# EAGLE design LB_BIT_i32_filter-v03(5_6) (EAGLE 6.6.0)
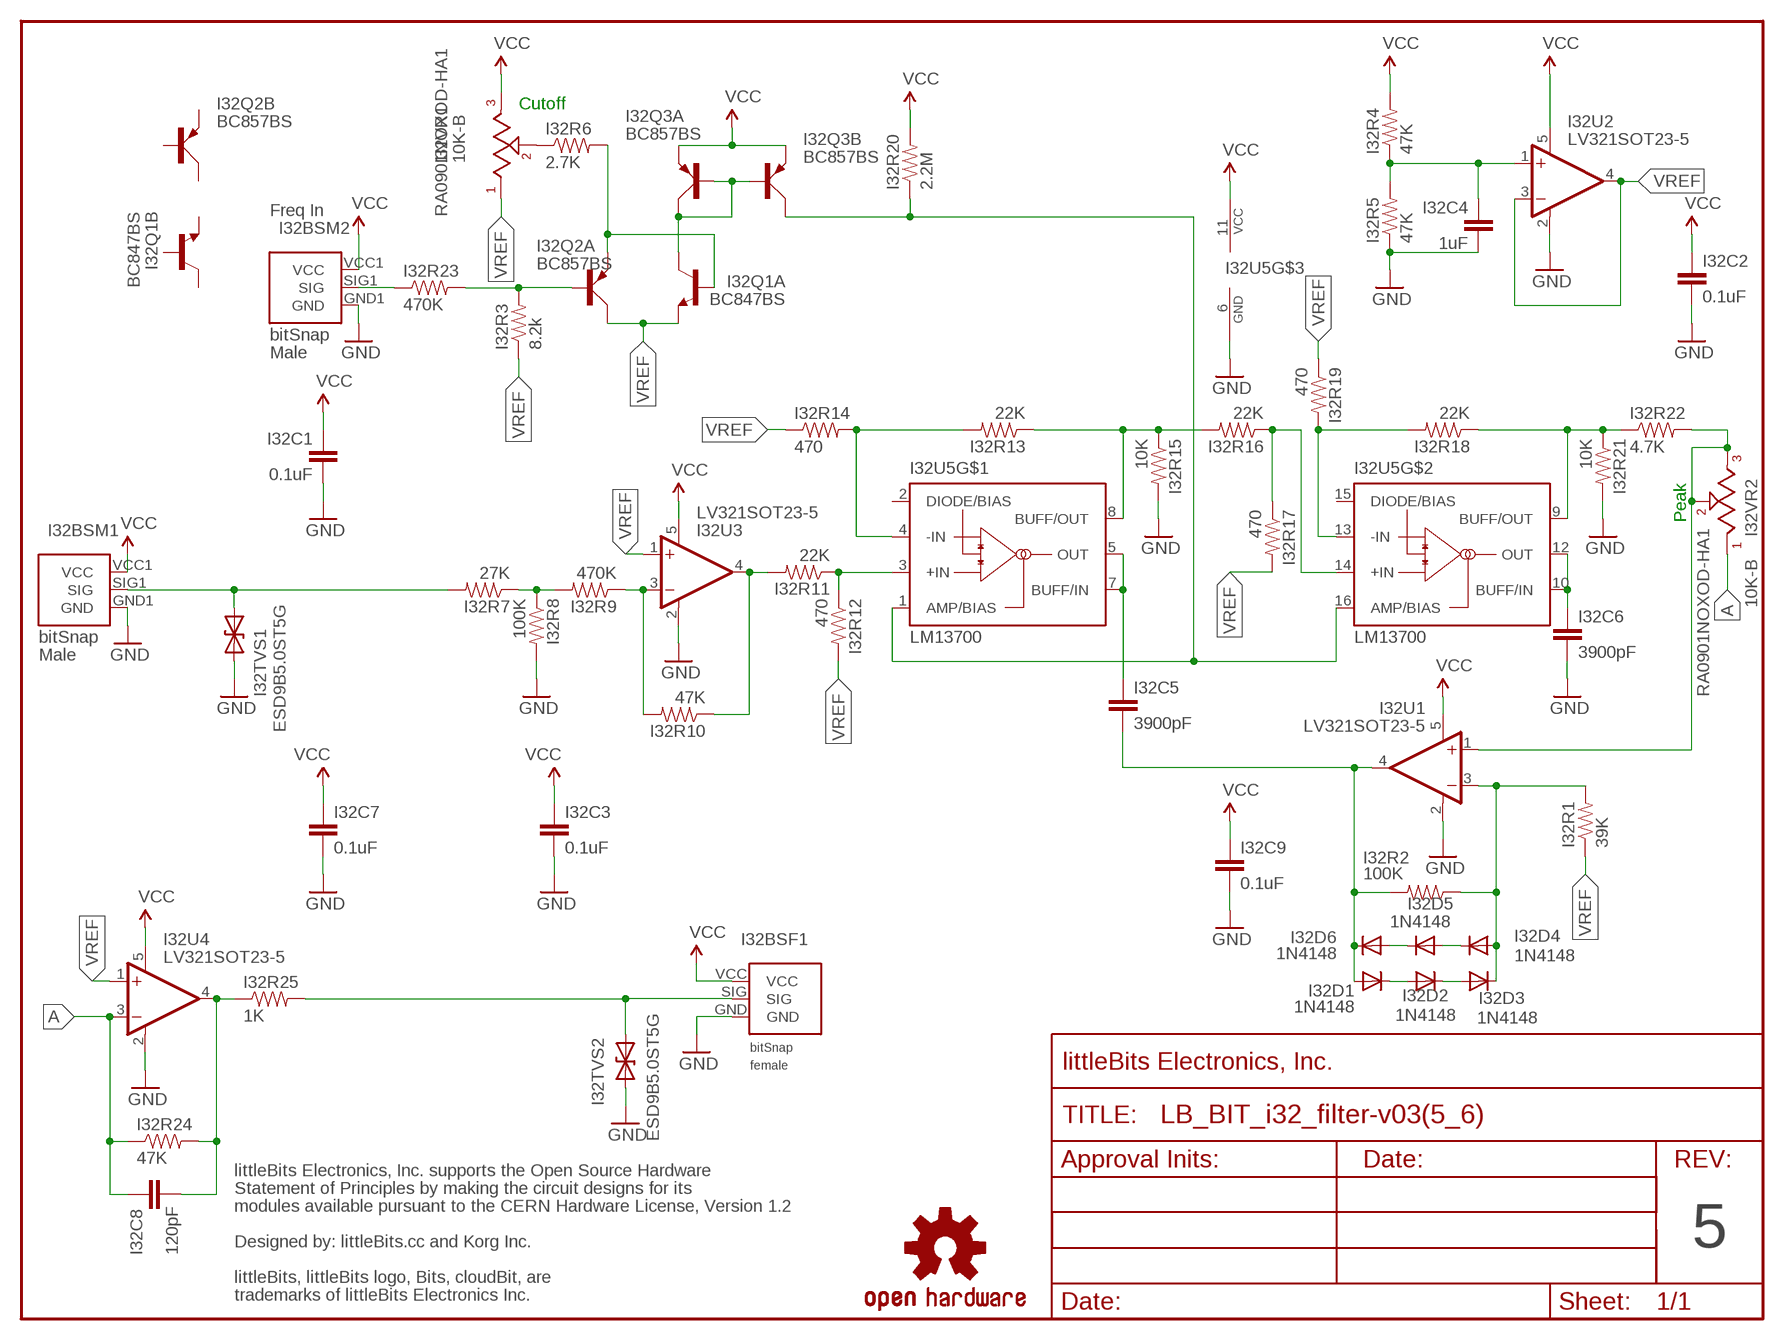
[diagram p0: schematic, sheet 1]

## Parts
I32BSF1  BITSNAP_V03_FEMALE  [BITSNAP_V03_FEMALE]
I32BSM1  BITSNAP_V03_MALE  [BITSNAP_V03_MALE]
I32BSM2  BITSNAP_V03_MALE  [BITSNAP_V03_MALE]
I32C1  0.1uF  CAPCAP-0603  [CAP-0603]
I32C2  0.1uF  CAPCAP-0603  [CAP-0603]
I32C3  0.1uF  CAPCAP-0603  [CAP-0603]
I32C4  1uF  CAPCAP-0603  [CAP-0603]
I32C5  3900pF  CAPCAP-0603  [CAP-0603]
I32C6  3900pF  CAPCAP-0603  [CAP-0603]
I32C7  0.1uF  CAPCAP-0603  [CAP-0603]
I32C8  120pF  CAPCAP-0603  [CAP-0603]
I32C9  0.1uF  CAPCAP-0603  [CAP-0603]
I32D1  1N4148  DIODESOD  [SOD-323]
I32D2  1N4148  DIODESOD  [SOD-323]
I32D3  1N4148  DIODESOD  [SOD-323]
I32D4  1N4148  DIODESOD  [SOD-323]
I32D5  1N4148  DIODESOD  [SOD-323]
I32D6  1N4148  DIODESOD  [SOD-323]
I32Q1  BC847BS  TRANS-BJT_NPN-DUAL-BC847BS  [SOT-363_PHILLIPS]
I32Q2  BC857BS  TRANS-BJT_PNP-DUALBC857  [SOT-363_PHILLIPS]
I32Q3  BC857BS  TRANS-BJT_PNP-DUALBC857  [SOT-363_PHILLIPS]
I32R1  39K  RESISTOR0603  [RES-0603]
I32R2  100K  RESISTOR0603  [RES-0603]
I32R3  8.2k  RESISTOR0603  [RES-0603]
I32R4  47K  RESISTOR0603  [RES-0603]
I32R5  47K  RESISTOR0603  [RES-0603]
I32R6  2.7K  RESISTOR0603  [RES-0603]
I32R7  27K  RESISTOR0603  [RES-0603]
I32R8  100K  RESISTOR0603  [RES-0603]
I32R9  470K  RESISTOR0603  [RES-0603]
I32R10  47K  RESISTOR0603  [RES-0603]
I32R11  22K  RESISTOR0603  [RES-0603]
I32R12  470  RESISTOR0603  [RES-0603]
I32R13  22K  RESISTOR0603  [RES-0603]
I32R14  470  RESISTOR0603  [RES-0603]
I32R15  10K  RESISTOR0603  [RES-0603]
I32R16  22K  RESISTOR0603  [RES-0603]
I32R17  470  RESISTOR0603  [RES-0603]
I32R18  22K  RESISTOR0603  [RES-0603]
I32R19  470  RESISTOR0603  [RES-0603]
I32R20  2.2M  RESISTOR0603  [RES-0603]
I32R21  10K  RESISTOR0603  [RES-0603]
I32R22  4.7K  RESISTOR0603  [RES-0603]
I32R23  470K  RESISTOR0603  [RES-0603]
I32R24  47K  RESISTOR0603  [RES-0603]
I32R25  1K  RESISTOR0603  [RES-0603]
I32TVS1  ESD9B5.0ST5G  DIODE-TVSSOD-923  [SOD-923]
I32TVS2  ESD9B5.0ST5G  DIODE-TVSSOD-923  [SOD-923]
I32U1  LV321SOT23-5  [SOT23-5]
I32U2  LV321SOT23-5  [SOT23-5]
I32U3  LV321SOT23-5  [SOT23-5]
I32U4  LV321SOT23-5  [SOT23-5]
I32U5  LM13700  XX-13700DMP16  [DMP16]
I32VR1  10K-B  ALPS_POTTH  [ALPS_POT]
I32VR2  10K-B  ALPS_POTTH  [ALPS_POT]
U$1  FRAME-LETTER-OHWOHW  [FABDWG01-OHW]
U$2  OSHWCREDIT-KORG  [OSHWCREDIT-KORG]
U$3  OSHW-LOGOL  [OSHW-LOGO-L]

## Nets
A: I32C8.1 I32R24.1 I32U4.3(-IN) I32VR2.1
GND: I32BSF1.GND I32BSM1.GND1(GND) I32BSM2.GND1(GND) I32C1.2 I32C2.2 I32C3.2 I32C4.2 I32C6.2 I32C7.2 I32C9.2 I32R5.1 I32R8.2 I32R15.2 I32R21.2 I32TVS1.1(A) I32TVS2.1(A) I32U1.2(V-) I32U2.2(V-) I32U3.2(V-) I32U4.2(V-) I32U5.6(GND)
N$1: I32C4.1 I32R4.1 I32R5.2 I32U2.1(+IN)
N$2: I32BSM1.SIG1(SIG) I32R7.2 I32TVS1.2(C)
N$3: I32R6.1 I32VR1.2
N$5: I32BSF1.SIG I32R25.2 I32TVS2.2(C)
N$6: I32Q1.2(A:B) I32Q2.1(A:E) I32R6.2
N$7: I32C5.2 I32D1.2(A) I32D6.1(C) I32R2.2 I32U1.4(OUT)
N$8: I32R11.1 I32R12.1 I32U5.3(+IN)
N$9: I32Q3.3(B:C) I32R20.1 I32U5.1(AMP/BIAS) I32U5.16(AMP/BIAS)
N$10: I32R7.1 I32R8.1 I32R9.2
N$11: I32R9.1 I32R10.2 I32U3.3(-IN)
N$12: I32R10.1 I32R11.2 I32U3.4(OUT)
N$13: I32R13.2 I32R14.2 I32U5.4(-IN)
N$14: I32R18.2 I32R19.2 I32U5.13(-IN)
N$15: I32R13.1 I32R15.1 I32R16.2 I32U5.8(BUFF/OUT)
N$16: I32C5.1 I32U5.5(OUT) I32U5.7(BUFF/IN)
N$17: I32R22.2 I32U1.1(+IN) I32VR2.2 I32VR2.3
N$18: I32R16.1 I32R17.1 I32U5.14(+IN)
N$19: I32R18.1 I32R21.1 I32R22.1 I32U5.9(BUFF/OUT)
N$20: I32C6.1 I32U5.10(BUFF/IN) I32U5.12(OUT)
N$22: I32C8.2 I32R24.2 I32R25.1 I32U4.4(OUT)
N$23: I32D3.1(C) I32D4.2(A) I32R1.2 I32R2.1 I32U1.3(-IN)
N$24: I32Q2.2(A:B) I32R3.2 I32R23.2
N$25: I32BSM2.SIG1(SIG) I32R23.1
N$27: I32D4.1(C) I32D5.2(A)
N$28: I32D5.1(C) I32D6.2(A)
N$30: I32D1.1(C) I32D2.2(A)
N$31: I32D2.1(C) I32D3.2(A)
N$33: I32Q1.6(A:C) I32Q3.2(A:B) I32Q3.5(B:B) I32Q3.6(A:C)
VCC: I32BSF1.VCC I32BSM1.VCC1(VCC) I32BSM2.VCC1(VCC) I32C1.1 I32C2.1 I32C3.1 I32C7.1 I32C9.1 I32Q3.1(A:E) I32Q3.4(B:E) I32R4.2 I32R20.2 I32U1.5(V+) I32U2.5(V+) I32U3.5(V+) I32U4.5(V+) I32U5.11(VCC) I32VR1.3
VREF: I32Q1.1(A:E) I32Q2.6(A:C) I32R1.1 I32R3.1 I32R12.2 I32R14.1 I32R17.2 I32R19.1 I32U2.3(-IN) I32U2.4(OUT) I32U3.1(+IN) I32U4.1(+IN) I32VR1.1
Unconnected: I32Q1.3(B:C) I32Q1.4(B:E) I32Q1.5(B:B) I32Q2.3(B:C) I32Q2.4(B:E) I32Q2.5(B:B) I32U5.2(DIODE/BIAS) I32U5.15(DIODE/BIAS)

## Notes on the sheet
- Cutoff
- Freq In | RA0901NOXOD-HA1
- Peak
- RA0901NOXOD-HA1
- 5

## Library data of the parts
I32BSF1 = bitSnap:BITSNAP_V03_FEMALE
I32BSM1 I32BSM2 = bitSnap:BITSNAP_V03_MALE
I32C1-I32C9 = LITTLEBITS:CAP
I32D1-I32D6 = LITTLEBITS:DIODE: Diode These are standard reverse protection diodes and small signal diodes. SMA package can handle up to about 1A. SOD-323 can handle about 200mA. What the SOD-323 package when ordering, there are some mfgs out there that are 5-pin packages.
I32Q1 = LITTLEBITS:TRANS-BJT_NPN-DUAL
I32Q2 I32Q3 = LITTLEBITS:TRANS-BJT_PNP-DUAL
I32R1-I32R25 = LITTLEBITS:RESISTOR
I32TVS1 I32TVS2 = LITTLEBITS:DIODE-TVS: Bidirectional Transient Voltage Suppression Diode: Device conducts in avalanche mode after reaching a part dependent voltage threshold. Used for limiting voltage spikes on ESD sensitive inputs and outputs.; IEC_ESD_PROT0: +/-18kV; LB_PN: ?; MPN: ESD9B5.0ST5G; V_CLAMP: ?; V_OPERATION: 5V
I32U1-I32U4 = LITTLEBITS:LV321
I32U5 = LITTLEBITS:XX-13700
I32VR1 I32VR2 = LITTLEBITS:ALPS_POT
U$1 = LITTLEBITS:FRAME-LETTER-OHW
U$2 = LITTLEBITS:OSHWCREDIT-KORG
U$3 = LITTLEBITS:OSHW-LOGO: Open Source Hardware Logo This logo indicates the piece of hardware it is found on incorporates a OSHW license and/or adheres to the definition of open source hardware found here: http://freedomdefined.org/OSHW

## Board
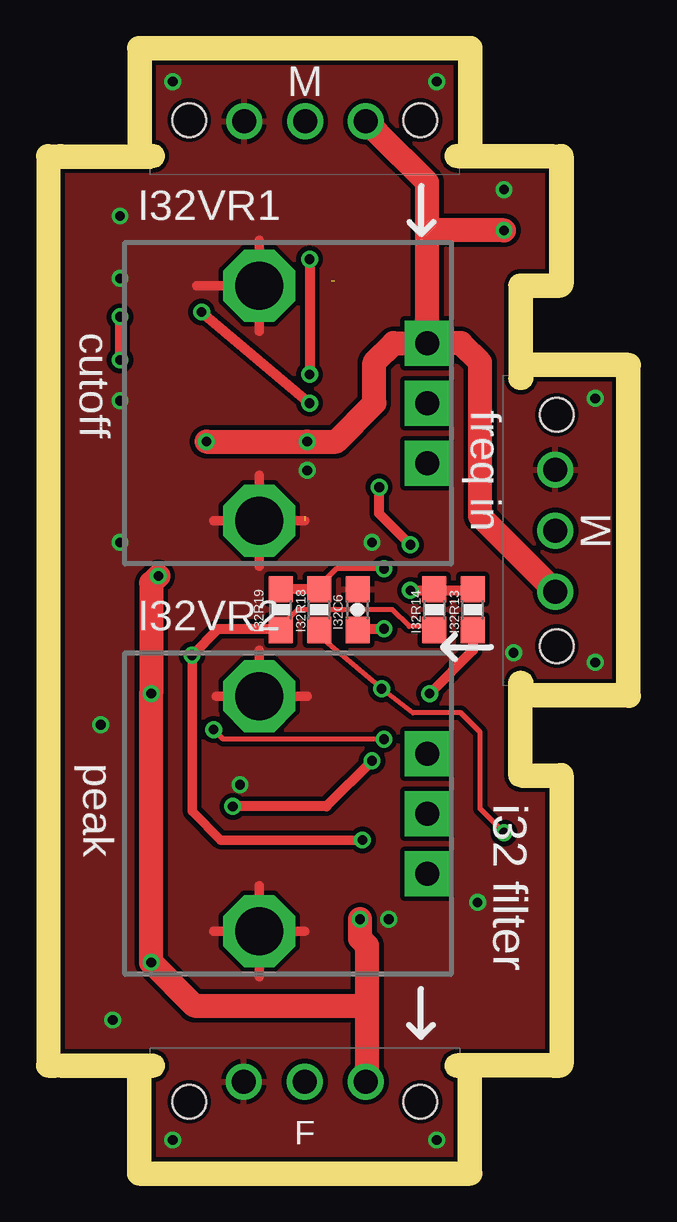
[diagram p1: board, top side]
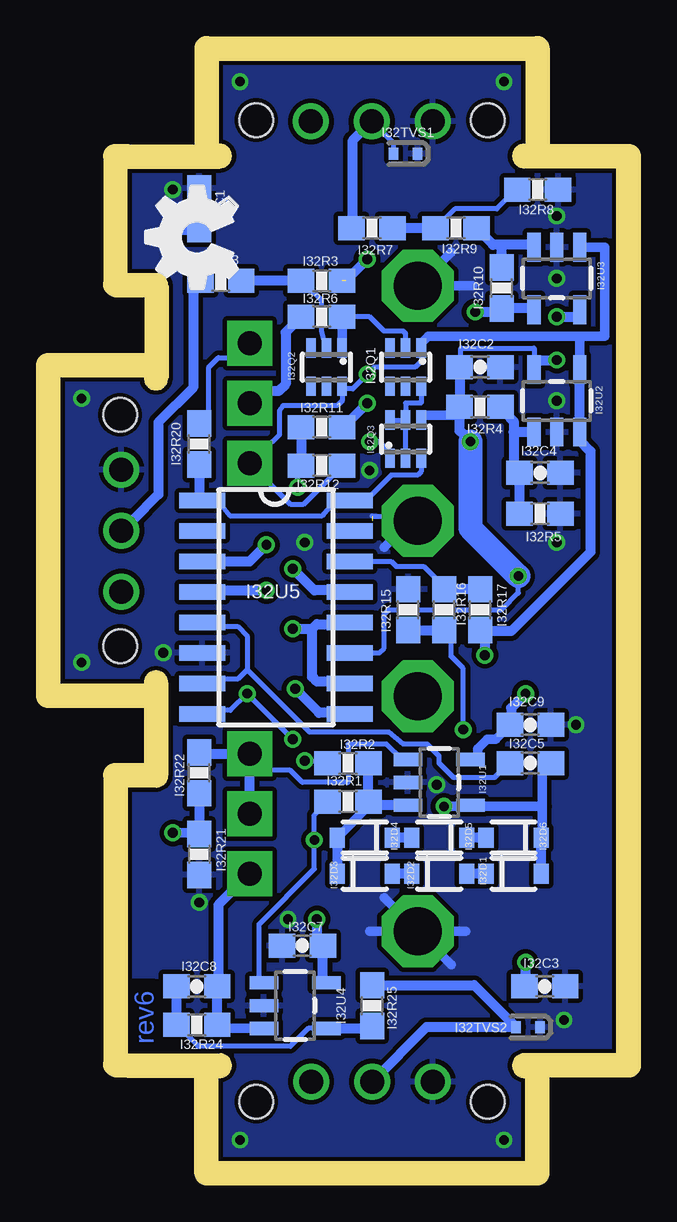
[diagram p2: board, bottom side, seen from below]

Size 23.2 x 45.9 mm. Coordinates in mm from the lower left corner, seen from the top.
Outline: 20.4,8.9 20.4,4.5
Outline: 20.4,4.55 20.4,15.6 19.2,15.6 arc-90 18.7,16.1
Outline: 20.4,41.4 20.4,37 19.2,37 arc90 18.7,36.5
Outline: 0,4.5 0,41.4
Copper layers (1*16): Top 0.035mm / dielectric 1.5mm / Bottom 0.035mm
Design rules "littleBitsDRC": minimum track width 0.2mm, minimum drill 0.4mm, track to track 0.2mm, track to pad 0.2mm, pad to pad 0.2mm, via to via 0.2mm, smd to smd 0mil, copper to edge 0.2mm, drill to drill 0.2mm, minimum pad ring 0.2mm, minimum via ring 0.15mm, stop-mask expansion 0.1mm, vias tented up to drill 0mil, thermal gap 0.2mm
Milling: 9 lines

### Footprints (pad centres in the part's own frame; a part is rotated, then mirrored left to right if it is on the bottom)
BITSNAP_V03_FEMALE = drill 1: GND 3.91,3.33; SIG 6.45,3.33; VCC 8.99,3.33 | hole 1.4: 1.63,2.5; 11.27,2.5
BITSNAP_V03_MALE = drill 1: GND1 8.98,2.56; SIG1 6.44,2.56; VCC1 3.9,2.56 | hole 1.4: 11.27,2.5; 1.63,2.5
CAP-0603 = smd 1.1 x 1: 1 -0.85,0; 2 0.85,0
SOD-323 = smd 0.63 x 0.83: 1 -1.15,0; 2 1.15,0
SOT-363_PHILLIPS = smd 0.4 x 0.8: 1 -0.65,-0.8; 2 0,-0.8; 3 0.65,-0.8; 4 0.65,0.8; 5 0,0.8; 6 -0.65,0.8
RES-0603 = smd 1.1 x 1: 1 -0.85,0; 2 0.85,0
SOD-923 = smd 0.4 x 0.5: 1 -0.5,0; 2 0.5,0
SOT23-5 = smd 0.55 x 1.2: 1 -0.95,-1.3; 2 0,-1.3; 3 0.95,-1.3; 4 0.95,1.3; 5 -0.95,1.3
DMP16 = smd 1.91 x 0.64: 1 -6.47,9.145; 2 -6.47,7.875; 3 -6.47,6.605; 4 -6.47,5.335; 5 -6.47,4.065; 6 -6.47,2.795; 7 -6.47,1.525; 8 -6.47,0.255; 9 -0.33,0.255; 10 -0.33,1.525; 11 -0.33,2.795; 12 -0.33,4.065; 13 -0.33,5.335; 14 -0.33,6.605; 15 -0.33,7.875; 16 -0.33,9.145
ALPS_POT = drill 1 pad 1.88 square: 1 7,-2.5; 2 7,0; 3 7,2.5 | drill 2 octagon: LUG1 0,-4.9; LUG2 0,4.9

### Placement (x,y rotation side)
I32BSF1  3.75,0 0 top
I32BSM1  16.65,45.9 180 top
I32BSM2  23.2,19.85 90 top
I32C1  17.4,39.7 90 bottom
I32C2  5.7,33.1 0 bottom
I32C3  3,7.3 0 bottom
I32C4  3.2,28.7 0 bottom
I32C5  3.6,16.6 0 bottom
I32C6  12.4,23 90 top
I32C7  13.1,9 180 bottom
I32C8  17.5,7.3 180 bottom
I32C9  3.6,18.2 0 bottom
I32D1  4.3,12 0 bottom
I32D2  7.4,12 0 bottom
I32D3  10.5,12 0 bottom
I32D4  10.5,13.5 180 bottom
I32D5  7.4,13.5 180 bottom
I32D6  4.3,13.5 180 bottom
I32Q1  8.8,33.1 180 bottom
I32Q2  12.1,33.1 180 bottom
I32Q3  8.8,30.1 0 bottom
I32R1  11.2,15 0 bottom
I32R2  11.2,16.6 180 bottom
I32R3  12.3,36.7 180 bottom
I32R4  5.7,31.45 180 bottom
I32R5  3.2,27 180 bottom
I32R6  12.3,35.2 0 bottom
I32R7  10.2,38.9 180 bottom
I32R8  3.3,40.5 0 bottom
I32R9  6.7,38.9 180 bottom
I32R10  4.8,36.4 90 bottom
I32R11  12.3,30.6 0 bottom
I32R12  12.3,29 0 bottom
I32R13  17.2,23 90 top
I32R14  15.6,23 90 top
I32R15  8.7,23 90 bottom
I32R16  7.2,23 270 bottom
I32R17  5.7,23 270 bottom
I32R18  10.8,23 90 top
I32R19  9.2,23 90 top
I32R20  17.4,29.9 90 bottom
I32R21  17.4,12.8 270 bottom
I32R22  17.4,16.2 90 bottom
I32R23  16.5,36.7 0 bottom
I32R24  17.5,5.7 180 bottom
I32R25  10.2,6.5 90 bottom
I32TVS1  8.8,42 180 bottom
I32TVS2  3.7,5.6 180 bottom
I32U1  7.4,15.8 270 bottom
I32U2  2.5,31.7 0 bottom
I32U3  2.5,36.8 180 bottom
I32U4  13.4,6.5 270 bottom
I32U5  10.8,18.4 0 bottom
I32VR1  8.3,31.6 0 top
I32VR2  8.3,14.5 0 top
U$1  0,0 0 top
U$2  -75.6,-70.25 0 top  (outside the outline)
U$3  -30.95,-67.6 0 top  (outside the outline)
U$8  [OSHW_FILLX150_NOTEXT]  15.81,35.56 0 top

### Tracks (layer width: path | path; a pad name or v marks a point on that pad's centre or on a via)
A
  Bottom 0.2: 16.5,5.55 I32R24.1 | 16.6,7.35 I32C8.1
  Bottom 0.4: I32U4.3 16.5,5.55
  Bottom 0.406: I32R24.1 I32C8.1 | I32VR2.1 16.6,10.7 16.6,7.35
GND  (via drill 0.41)  (1 unrouted)
  Top 0.4: 8.3,7.7 8.3,11.5 | 10.2,9.6 6.4,9.6 | 8.3,24.8 8.3,28.6 | 10.2,26.7 6.4,26.7 | 8.3,34.6 8.3,38.4 | 10.3,19.4 6.5,19.4 | 8.3,21.3 8.3,18.2 | 9.5,36.5 5.7,36.5
  Bottom 0.2: 10.2,26.9 8.9,26.9
  Bottom 0.4: 6.3,9.6 10.3,9.6 | 9.7,11 6.9,8.2 | 6,36.5 9.6,36.5 | 6.9,37.9 9.2,35.6 | 8.9,26.9 8.9,26.4 9.7,25.6
  other vias: 15.7,0.9 4.7,0.9 22.3,20.8 22.3,31.8 15.7,45 4.7,45 2.5,39.4 18.5,40.5 2.5,25.8 10.3,28.8 1.7,18.2 17.4,10.8 13.7,10.1 2.5,31.7 2.5,36.8 7.5,15.7 18.9,21.2 13,25.8 2.2,5.9
  pour Bottom: 0,0 23.2,0 23.2,45.9 0,45.9
  pour Top: 0,0 23.2,0 23.2,45.9 0,45.9
N$1
  Bottom 0.406: I32R5.2 I32C4.1 4.3,28.7 4.3,30.4 | I32R4.1 4.3,30.85 4.3,30.4 | I32U2.1 | I32U2.1 4.3,30.4
N$2
  Bottom 0.2: I32R7.2 11.2,38.9
  Bottom 0.203: I32TVS1.2 9.3,42.43 I32BSM1.SIG1
  Bottom 0.406: I32R7.2 11,38.9 11,42.55 I32BSM1.SIG1
N$3
  Bottom 0.406: I32R6.1 13.8,34.55 13.8,32.4 14.1,32.1 14.8,32.1 I32VR1.2
N$5
  Bottom 0.2: 10.1,7.45 I32R25.2
  Bottom 0.406: I32BSF1.SIG 7.93,5.6 I32TVS2.2 5.95,7.35 I32R25.2
N$6
  Bottom 0.2: I32Q1.2 8.8,34.5 8.9,34.6 9.7,34.6 10.3,35.2 I32R6.2
  Bottom 0.4: I32Q2.1 I32R6.2
N$7  (via drill 0.41)
  Top 0.406: v13,16.7 11.1,14.8 v7.2,14.8
  Bottom 0.2: I32D6.1 3.1,13.65 | 3.1,16.6 I32C5.2 | I32U1.4 6.1,14.7 v7.2,14.8 | I32R2.2 12.05,16.65 v13,16.7
  Bottom 0.4: 3.1,13.65 3.1,14.8 | 3.1,14.8 3.1,16.6 | v7.2,14.8 3.1,14.8
  Bottom 0.406: I32D1.2 I32D6.1
N$8  (via drill 0.41)
  Top 0.406: v14.6,25.7 13.3,27 v13.3,28.1
  Bottom 0.2: v13.3,28.1 13.3,28.85 I32R12.1
  Bottom 0.406: I32R11.1 I32R12.1 | I32U5.3 15.29,25 v14.6,25.7
N$9
  Bottom 0.2: I32Q3.3 8.15,28.75 8.3,28.6 9.4,28.6 10.5,27.5 11.09,27.5 I32U5.16 | 17.4,27.68 I32U5.1
  Bottom 0.203: I32U5.16 11.76,27.55 12.3,26.9 16.1,26.9 16.5,27.4
  Bottom 0.254: 16.5,27.4 17.27,27.4 I32U5.1
  Bottom 0.406: I32R20.1 17.4,27.68
N$10
  Bottom 0.2: I32R8.1 4.3,40.5 4.3,40.4 5,39.7 6.75,39.7 I32R9.2
  Bottom 0.406: I32R9.2 I32R7.1
N$11
  Bottom 0.406: I32U3.3 3.45,38.2 4.8,38.2 | 4.8,38.2 5.15,38.2 I32R9.1 | I32R10.2 4.8,38.2
N$12  (via drill 0.41)
  Top 0.406: v5.9,35.4 v10.4,31.6
  Bottom 0.2: I32U3.4 3.45,35.55 | I32R10.1 4.8,35.4 | 11.2,30.8 I32R11.2
  Bottom 0.406: 3.45,35.55 I32R10.1 | 4.8,35.4 v5.9,35.4 | v10.4,31.6 11.2,30.8
N$13  (via drill 0.41)
  Top 0.2: 17.15,23.8 arc90 I32R13.2 | I32R14.2 14.65,23.85 v14.6,23.8
  Top 0.406: v14.6,23.8 17.15,23.8
  Bottom 0.2: I32U5.4 17.11,23.8
  Bottom 0.406: 17.11,23.8 v14.6,23.8
N$14  (via drill 0.41)
  Top 0.2: v13.5,24.7 11.5,24.7 10.8,24 I32R18.2
  Top 0.406: I32R18.2 I32R19.2
  Bottom 0.2: I32U5.13 11.2,23.8
  Bottom 0.406: 11.2,23.8 12.6,23.8 v13.5,24.7
N$15  (via drill 0.41)
  Top 0.2: v13.5,17.6 6.8,17.6 v6.4,18
  Top 0.406: I32R13.1 17.2,21.3 v15.4,19.5
  Bottom 0.2: I32U5.8 17.12,18.8 16.1,18.8 v15.4,19.5 v13.5,17.6 | v6.4,18 6.4,20.55 6.9,21.05 6.9,21.9 I32R16.2
  Bottom 0.406: I32R15.1 I32R16.2
N$16
  Bottom 0.2: I32U5.5 16.86,22.36 16.7,22.3 15.8,22.3 15.4,21.9 15.4,20.5 | 15.4,20.5 15.8,20.1 17.25,20.1 I32U5.7 | I32C5.1 4.5,16.6 5.1,16 6.8,16 7.4,16.6 7.4,16.9 7.9,17.4 8.9,17.4 9.5,17.9 12.8,17.9 15.4,20.5
N$17
  Bottom 0.2: 15.35,17.05 I32VR2.3 14.6,16.3 13.6,16.3 13.1,15.8 11.2,15.8 11.2,17.4 9.6,17.4 8.95,16.75 I32U1.1 | I32R22.2 17.35,17
  Bottom 0.406: I32VR2.2 I32VR2.3 17.35,17
N$18
  Bottom 0.2: I32U5.14 9.4,25 9.2,24.8 8.05,24.8 7.2,23.95 I32R16.1
  Bottom 0.406: I32R17.1 I32R16.1
N$19  (via drill 0.41)
  Top 0.2: I32R18.1 11,21.8 10.9,21.8 v13.4,19.7 14.7,18.7 16.7,18.7 17.5,17.9 17.5,14.7 v18.5,13.7
  Bottom 0.2: I32U5.9 11.86,18.66 11.9,18.7 | I32R22.1 17.75,15 | 17.45,13.7 arc90 I32R21.1
  Bottom 0.4: v18.5,13.7 17.45,13.7
  Bottom 0.406: 11.9,18.7 12.4,18.7 v13.4,19.7 | I32R22.1 I32R21.1
N$20  (via drill 0.41)
  Top 0.2: I32C6.1 12.45,22.2
  Top 0.406: 12.45,22.2 v13.5,22.2
  Bottom 0.2: I32U5.10 11.21,20 | 11.2,22.4 I32U5.12
  Bottom 0.406: 11.21,20 12.5,20 12.7,20.2 12.7,22.2 | 12.7,22.2 12.5,22.4 11.2,22.4 | v13.5,22.2 12.7,22.2
N$22
  Bottom 0.2: 10.3,5.55 I32R25.1 | I32U4.4 12.85,5.55 13.6,4.8 17.45,4.8 I32R24.2
  Bottom 0.406: I32U4.4 10.3,5.55 | I32C8.2 I32R24.2
N$23
  Bottom 0.2: 10.2,14.85 I32R1.2 10.35,14.8
  Bottom 0.4: 10.35,14.8 I32D4.2
  Bottom 0.406: I32D4.2 I32D3.1 | I32U1.3 10.2,14.85 | I32R1.2 I32R2.1
N$24
  Bottom 0.2: I32Q2.2 12.3,34.6 12.3,35.9 12.9,36.5 12.75,36.4 I32R3.2
  Bottom 0.406: I32R3.2 I32R23.2
N$25
  Bottom 0.406: I32R23.1 17.2,36.7 arc-90 17.65,36.35 17.65,32.25 19.1,30.8 19.1,27.8 20.2,26.7 20.23,26.7 I32BSM2.SIG1
N$27
  Bottom 0.406: I32D5.2 I32D4.1
N$28
  Bottom 0.406: I32D6.2 I32D5.1
N$30
  Bottom 0.406: I32D1.1 I32D2.2
N$31
  Bottom 0.406: I32D2.1 I32D3.2
N$33
  Bottom 0.2: I32Q3.2 I32Q3.5 | I32Q3.6 I32Q3.5 | I32Q1.6 8.15,31.6 8.8,31.6 I32Q3.5
VCC  (via drill 0.41)
  Top 0.2: I32BSF1.VCC 12.8,3.4 | 13.2,42.9 13.19,42.9
  Top 0.406: I32BSM2.VCC1 | v2.5,33.4 v2.5,35.2
  Top 1: I32BSM2.VCC1 17.5,26.9 17.5,33.3 16.7,34.1 I32VR1.3 | 12.8,3.4 12.8,6.5 | 12.8,6.5 12.8,9 12.5,9.3 v12.5,10.1 | 12.8,6.5 5.6,6.5 v3.8,8.3 v3.8,19.5 3.8,24.1 v4.1,24.4 | I32VR1.3 15.3,38.8 | 15.3,38.8 15.3,40.8 13.2,42.9 | 13.19,42.9 I32BSM1.VCC1 | v18.5,38.8 15.3,38.8 | I32VR1.3 13.9,34.1 13.1,33.3 13.1,31.6 11.5,30 v10.3,30 v6.1,30
  Bottom 0.2: 3.8,7.35 I32C3.1 3.85,7.45 | I32U4.5 12.25,7.6 | 4.4,18.25 I32C9.1 | I32U1.5 5.8,16.75 | I32U5.11 9.9,21.2 9.7,21.4 9.7,22.8 9.5,23 4.8,23 4.1,23.7 v4.1,24.4 | 17.3,38.8 17.25,38.85 I32C1.1 17.2,38.75 | I32C2.1 6.5,33.4 6.5,33.9 3.45,33.9 I32U2.5 3.45,33.4 | I32R20.2 17.5,30.75 17.5,31.2 17,31.2 17,33.1 16.6,33.5 16.1,33.5 15.5,34.1 I32VR1.3 | 6.5,31.4 I32R4.2 6.65,31.1 | I32Q3.1 9.5,29.6 9.9,30 v10.3,30 | I32Q3.4 8.15,31.1 | 1.55,35.2 I32U3.5
  Bottom 0.4: 5.8,16.75 5.8,17.2 5.4,17.6 5.05,17.6 I32C9.1 | 8.15,31.1 6.65,31.1
  Bottom 0.406: I32C2.1 I32R4.2 | v12.5,10.1 12.5,9.19 I32C7.1 12.25,7.6 | 3.8,7.35 v3.8,8.3 | v3.8,19.5 4.4,18.9 4.4,18.25 | 17.3,38.8 v18.5,38.8 | 3.45,33.4 v2.5,33.4 | v2.5,35.2 1.55,35.2 | 6.65,31.1 arc-90 I32R4.2 | v6.1,30 6.55,30.45 I32R4.2
  Bottom 1: v6.1,30 6.1,26.4 v4.1,24.4
VREF  (via drill 0.41)  (1 unrouted)
  Top 0.2: 9.05,22.2 I32R19.1 | I32R19.1 9.2,22.1 | I32R14.1 15.5,22.3 14.55,22.3 13.85,23 9.9,23 9.2,22.3 I32R19.1
  Top 0.4: v12.6,13.4 6.7,13.4 5.5,14.6 v5.5,21.1
  Top 0.406: v5.5,21.1 6.6,22.2 9.05,22.2 | v10.4,37.6 v10.4,32.8
  Bottom 0.2: I32Q1.1 8.15,33.35 8.4,33.1 10.1,33.1 v10.4,32.8 11,32.2 11.35,32.2 11.4,32.15 I32Q2.6 | I32U2.3 1.55,30.05 | 5.65,22.1 I32R17.2 | 8.15,34.15 8.15,34.1 | I32R1.1 12.6,14.45 v12.6,13.4 12.6,12.2 14.9,9.9 14.9,7.5 15,7.5 15,7.45 I32U4.1
  Bottom 0.203: I32R12.2 13.05,27.4 13.6,27.4 I32VR1.1 14.05,30.3 14.05,31.3 13.9,31.5 11.65,31.5 11.45,31.7 11.45,32.25 11.4,32.2 11.4,32.15
  Bottom 0.4: I32U3.1 0.5,38.1 0.5,34.4 1.55,34.4 | 1.55,34.4 I32U2.4 | I32Q1.1 8.15,34.1 7.85,34.4 1.55,34.4
  Bottom 0.406: I32U2.3 I32U2.4 | I32R17.2 5.5,22.1 v5.5,21.1 | 1.55,30.05 1.1,29.6 1.1,25.4 4.4,22.1 5.65,22.1 | 11.3,36.7 v10.4,37.6

### Text on the board
Bottom: rev6
tPlace: cutoff | freq in | peak | i32 filter
Reference: XLARGE
dxf: 6 | Voltage Controlled Filter Bit